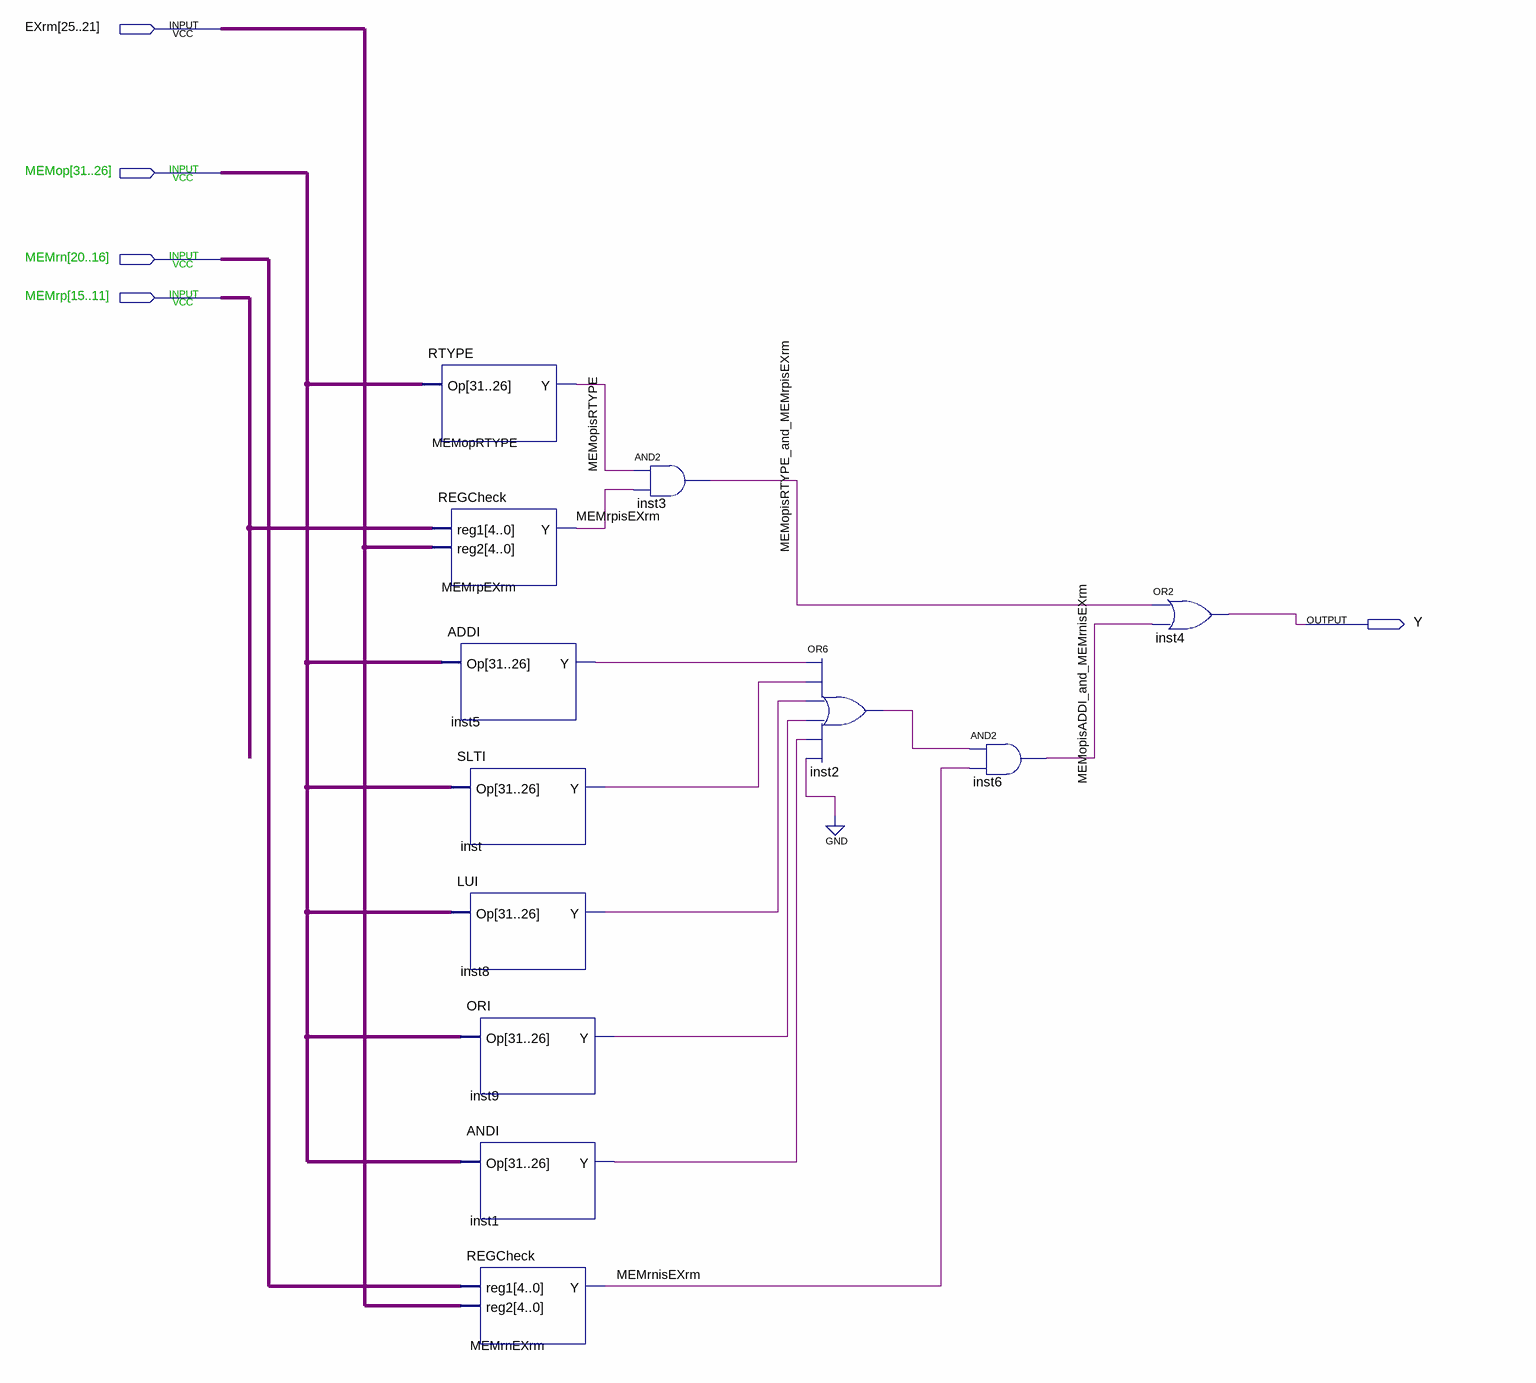
[diagram p0: schematic sheet]
// Quartus schematic ForwardAfromMEMtoEX.bdf as structural Verilog: 12 symbols, 5 pins
module ForwardAfromMEMtoEX (
  input  [25:21] EXrm,
  input  [31:26] MEMop,
  input  [20:16] MEMrn,
  input  [15:11] MEMrp,
  output Y
);

  wire inst1_y, inst2_out, inst5_y, inst8_y, inst9_y, inst_y, MEMopisADDI_and_MEMrnisEXrm, MEMopisRTYPE,
       MEMopisRTYPE_and_MEMrpisEXrm, MEMrnisEXrm, MEMrpisEXrm;

  RTYPE MEMopRTYPE (.Op(MEMop), .Y(MEMopisRTYPE));
  REGCheck MEMrpEXrm (.reg1(MEMrp), .reg2(EXrm), .Y(MEMrpisEXrm));
  ADDI inst5 (.Op(MEMop), .Y(inst5_y));
  SLTI inst (.Op(MEMop), .Y(inst_y));
  LUI inst8 (.Op(MEMop), .Y(inst8_y));
  ORI inst9 (.Op(MEMop), .Y(inst9_y));
  ANDI inst1 (.Op(MEMop), .Y(inst1_y));
  REGCheck MEMrnEXrm (.reg1(MEMrn), .reg2(EXrm), .Y(MEMrnisEXrm));
  and inst3 (MEMopisRTYPE_and_MEMrpisEXrm, MEMopisRTYPE, MEMrpisEXrm);
  or inst2 (inst2_out, inst5_y, inst_y, inst8_y, inst9_y, inst1_y, 1'b0);
  and inst6 (MEMopisADDI_and_MEMrnisEXrm, inst2_out, MEMrnisEXrm);
  or inst4 (Y, MEMopisRTYPE_and_MEMrpisEXrm, MEMopisADDI_and_MEMrnisEXrm);
endmodule
